# EAGLE design clip_LMT84_v2 (EAGLE 7.6.0)
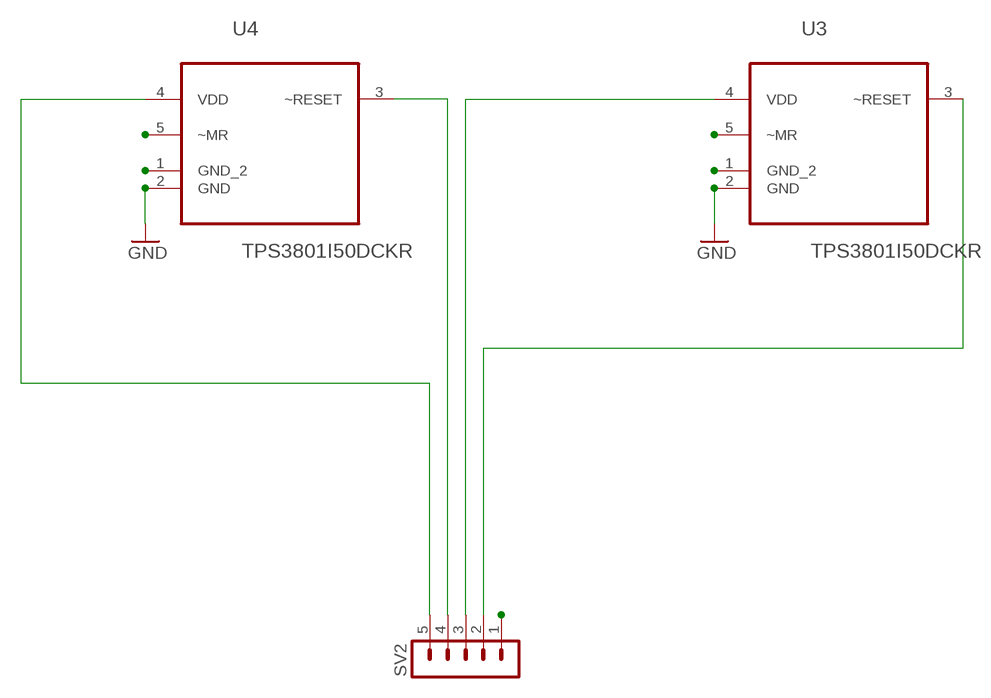
[diagram p0: schematic, sheet 1]

## Parts
SV2  MA05-1  [MA05-1]
U3  TPS3801I50DCKR  [SOT65P210X110-5N]
U4  TPS3801I50DCKR  [SOT65P210X110-5N]

## Nets
GND: SV2.1 U3.1(GND_2) U3.2(GND) U3.5(~MR) U4.1(GND_2) U4.2(GND) U4.5(~MR)
N$1: SV2.3 U3.4(VDD)
N$2: SV2.5 U4.4(VDD)
N$3: SV2.4 U4.3(~RESET)
VOUT_AIR: SV2.2 U3.3(~RESET)

## Library data of the parts
SV2 = con-lstb:MA05-1: PIN HEADER; OC_FARNELL: unknown; OC_NEWARK: unknown
U3 U4 = Texas Instruments_By_element14_Batch_1:TPS3801I50DCKR: VOLTAGE SUPERVISORS; MPN: TPS3801I50DCKR; OC_FARNELL: 1652466; OC_NEWARK: 77C0385; PACKAGE: SC-70-5; SUPPLIER: Texas Instruments

## Board
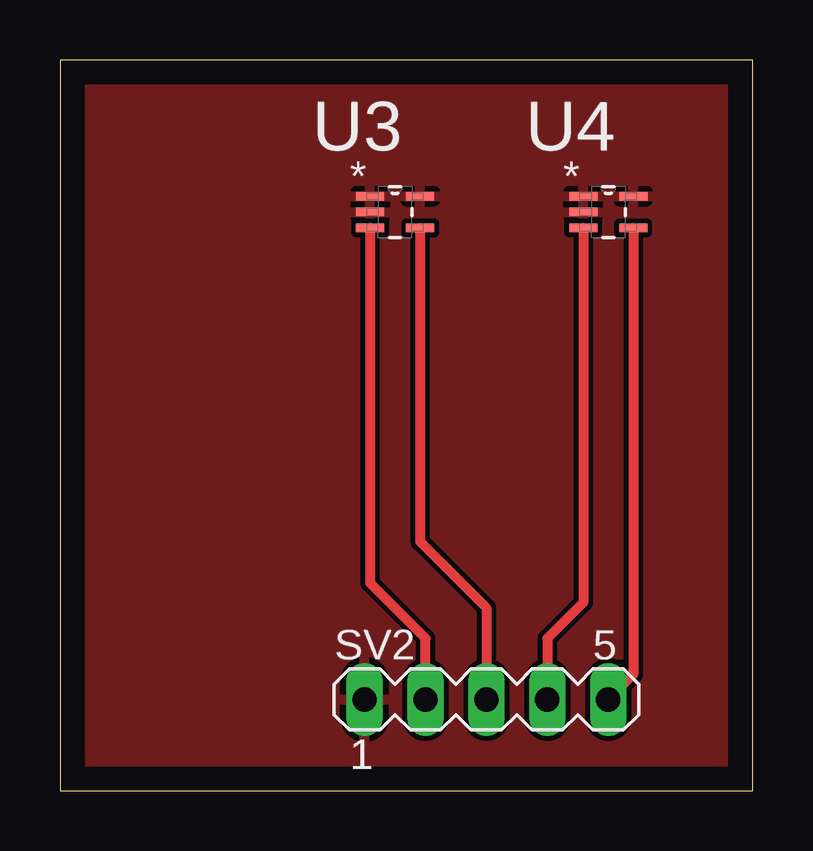
[diagram p1: board, top side]

Size 28.88 x 30.47 mm. Coordinates in mm from the lower left corner, seen from the top.
Outline: 0,0 28.88,0 28.88,30.47 0,30.47 0,0
Copper layers (1*16): Top 0.035mm / dielectric 1.5mm / Bottom 0.035mm
Design rules "default": minimum track width 10mil, minimum drill 24mil, track to track 8mil, track to pad 8mil, pad to pad 8mil, via to via 8mil, smd to smd 8mil, copper to edge 40mil, drill to drill 8mil, minimum pad ring 10mil, minimum via ring 8mil, stop-mask expansion 4mil, vias tented up to drill 0mil, thermal gap 10mil

### Footprints (pad centres in the part's own frame; a part is rotated, then mirrored left to right if it is on the bottom)
MA05-1 = drill 1.016 long: 1 -5.08,0; 2 -2.54,0; 3 0,0; 4 2.54,0; 5 5.08,0
SOT65P210X110-5N = smd 1.168 x 0.356: 1 -1.041,0.66; 2 -1.041,0; 3 -1.041,-0.66; 4 1.041,-0.66; 5 1.041,0.66

### Placement (x,y rotation side)
SV2  17.78,3.81 0 top
U3  13.97,24.13 0 top
U4  22.86,24.13 0 top

### Tracks (layer width: path | path; a pad name or v marks a point on that pad's centre or on a via)
GND
  pour Top: -34.29,81.28 -34.29,-3.81 73.66,-3.81 73.66,82.55 -34.29,82.55
N$1
  Top 0.406: U3.4 15.01,10.39 17.78,7.62 SV2.3
N$2
  Top 0.406: U4.4 23.9,4.85 SV2.5
N$3
  Top 0.406: U4.3 21.82,7.85 20.32,6.35 SV2.4
VOUT_AIR
  Top 0.406: U3.3 12.93,8.66 15.24,6.35 SV2.2